# Altium project PCB_Project1.PrjPCB
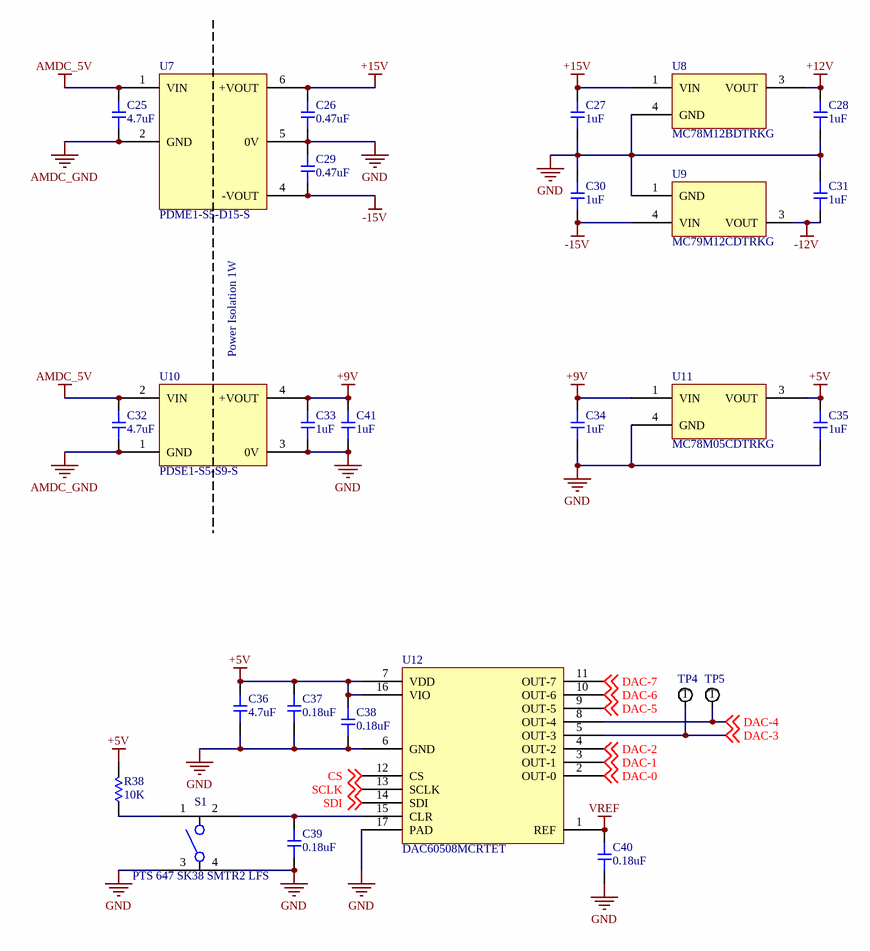
[diagram p0: DAC.SchDoc]
1 sheet, 27 parts. Net scope: global (net labels, ports and power ports of the same name join across sheets).
Board file: PCB1.PcbDoc

## Sheet DAC.SchDoc: DAC
size Letter; Engineer: Brandt Buchda; SheetNumber: 2; SheetTotal: 4

### Parts
C25  value 4.7uF  [0603-CAP]  (hidden comment: CL10A475KA8NQNC)
C26  value 0.47uF  [0603-CAP]  (hidden comment: CL10B474KO8NNNC)
C27  value 1uF  [0603-CAP]  (hidden comment: CL10A105KP8NNNC)
C28  value 1uF  [0603-CAP]  (hidden comment: CL10A105KP8NNNC)
C29  value 0.47uF  [0603-CAP]  (hidden comment: CL10B474KO8NNNC)
C30  value 1uF  [0603-CAP]  (hidden comment: CL10A105KP8NNNC)
C31  value 1uF  [0603-CAP]  (hidden comment: CL10A105KP8NNNC)
C32  value 4.7uF  [0603-CAP]  (hidden comment: CL10A475KA8NQNC)
C33  value 1uF  [0603-CAP]  (hidden comment: CL10A105KP8NNNC)
C34  value 1uF  [0603-CAP]  (hidden comment: CL10A105KP8NNNC)
C35  value 1uF  [0603-CAP]  (hidden comment: CL10A105KP8NNNC)
C36  value 4.7uF  [0603-CAP]  (hidden comment: CL10A475KA8NQNC)
C37  value 0.18uF  [0603-CAP]  (hidden comment: CC0603KRX7R7BB184)
C38  value 0.18uF  [0603-CAP]  (hidden comment: CC0603KRX7R7BB184)
C39  value 0.18uF  [0603-CAP]  (hidden comment: CC0603KRX7R7BB184)
C40  value 0.18uF  [0603-CAP]  (hidden comment: CC0603KRX7R7BB184)
C41  value 1uF  [0603-CAP]  (hidden comment: CL10A105KP8NNNC)
R38  value 10K  [0603-RES]  (hidden comment: ERJ-PB3B1002V)
S1  PTS 647 SK38 SMTR2 LFS  [PTS647SK38SMTR2LFSCT-ND]
TP4  Test Point  [RCU-0C]  (value not drawn)
TP5  Test Point  [RCU-0C]  (value not drawn)
U7  PDME1-S5-D15-S  [PDME1-S5-D15-S]
U8  MC78M12BDTRKG  [DPAK229P991X238-3N]
U9  MC79M12CDTRKG  [DPAK229P991X238-3N]
U10  PDSE1-S5-S9-S  [PDSE1-S5-S9-S]
U11  MC78M05CDTRKG  [DPAK229P991X238-3N]
U12  DAC60508MCRTET  [QFN50P300X300X80_HS-17N]

### Nets
+5V: C35.2 C36.2 C37.2 C38.2 R38.2 U11.3(VOUT) U12.7(VDD) U12.16(VIO)
+9V: C33.2 C34.2 C41.2 U10.4(+VOUT) U11.1(VIN)
+12V: C28.2 U8.3(VOUT)
+15V: C26.2 C27.2 U7.6(+VOUT) U8.1(VIN)
-12V: C31.1 U9.3(VOUT)
-15V: C29.1 C30.1 U7.4(-VOUT) U9.4(VIN)
AMDC_5V: C25.2 C32.2 U7.1(VIN) U10.2(VIN)
AMDC_GND: C25.1 C32.1 U7.2(GND) U10.1(GND)
GND: C26.1 C27.1 C28.1 C29.2 C30.2 C31.2 C33.1 C34.1 C35.1 C36.1 C37.1 C38.1 C39.1 C40.1 C41.1 S1.3 S1.4 U7.5(0V) U8.4(GND) U9.1(GND) U10.3(0V) U11.4(GND) U12.6(GND) U12.17(PAD)
VREF: C40.2 U12.1(REF)
CS: U12.12(CS) ; off-sheet CS
DAC-0: U12.2(OUT-0) ; off-sheet DAC-0
DAC-1: U12.3(OUT-1) ; off-sheet DAC-1
DAC-2: U12.4(OUT-2) ; off-sheet DAC-2
DAC-3: TP4.1 U12.5(OUT-3) ; off-sheet DAC-3
DAC-4: TP5.1 U12.8(OUT-4) ; off-sheet DAC-4
DAC-5: U12.9(OUT-5) ; off-sheet DAC-5
DAC-6: U12.10(OUT-6) ; off-sheet DAC-6
DAC-7: U12.11(OUT-7) ; off-sheet DAC-7
SCLK: U12.13(SCLK) ; off-sheet SCLK
SDI: U12.14(SDI) ; off-sheet SDI
NetC39_2: C39.2 S1.2 U12.15(CLR)
NetR38_1: R38.1 S1.1

### Notes on the sheet
- Power Isolation 1W
- Title:
- File:
- Sheet:
- of
- Revision:
- Time:
- Date:
- Engineer:
- (in symbol Test Point) T

### Library data of the parts
C25 C32 C36 = Capacitor 4.7uF: 4.7µF ±10% 25V Ceramic Capacitor X5R 0603 (1608 Metric); Supplier 1: Digi-Key; Supplier Part Number 1: 1276-1900-1-ND
C26 C29 = Capacitor .47uF: 0.47µF ±10% 16V Ceramic Capacitor X7R 0603 (1608 Metric); Supplier 1: Digi-Key; Supplier Part Number 1: 1276-1062-1-ND
C27 C28 C30 C31 C33-C35 C41 = Capacitor 1uF: 1µF ±10% 10V Ceramic Capacitor X5R 0603 (1608 Metric); Supplier 1: Digi-Key; Supplier Part Number 1: 1276-1182-1-ND
C37-C40 = Capacitor 0.18uF: 0.18µF ±10% 16V Ceramic Capacitor X7R 0603 (1608 Metric); Supplier 1: Digi-Key; Supplier Part Number 1: 311-4066-1-ND
R38 = Resistor 10K: 10 kOhms ±0.1% 0.2W, 1/5W Chip Resistor 0603 (1608 Metric) Automotive AEC-Q200, Pulse Withstanding Thick Film; Supplier 1: Digi-Key; Supplier Part Number 1: P20086CT-ND
S1 = PTS 647 SK38 SMTR2 LFS: Tactile Switch SPST-NO Top Actuated Surface Mount; Supplier 1: Digi-Key; Supplier Part Number 1: PTS647SK38SMTR2LFSCT-ND
TP4 TP5 = Test Point: Material - Insulation: No Insulation; Supplier Part Number: *; Supplier: *; Footprint: *; Supplier 1: Digi-Key; RoHS: RoHS Compliant; Category: Test and Measurement; Stock 1: 136646; Pricing 1: 1=0.22, 10=0.206, 25=0.1756, 50=0.1536, 100=0.1426, 250=0.12616, 500=0.12068, 1000=0.09874 (USD); Packaging: Cut Tape (CT); Part Status: Active; Type: PC Test Point; Mounting Type: Surface Mount; Color: Natural; Size / Dimension: 0.063" x 0.031" x 0.045" (1.60mm x 0.80mm x 1.15mm); Plating: -; Material - Body: -; ComponentLink1URL: http://www.te.com/commerce/DocumentDelivery/DDEController?Action=srchrtrv&DocNm=1773266&DocType=DS&DocLang=English; ComponentLink1Description: http://www.te.com/commerce/DocumentDelivery/DDEController?Action=srchrtrv&DocNm=1773266&DocType=DS&DocLang=English; Supplier Part Number 1: A106145CT-ND
U7 = PDME1-S5-D15-S: Isolated Module DC DC Converter 2 Output 15V -15V   34mA, 34mA 4.5V - 5.5V Input; Supplier 1: Digi-Key; Supplier Part Number 1: 102-6323-ND
U8 = MC78M12BDTRKG: +12 Linear Voltage Regulator IC  1 Output  500mA DPAK; Supplier 1: Digi-Key; Supplier Part Number 1: MC78M12BDTRKGOSCT-ND
U9 = MC79M12CDTRKG: -12 Linear Voltage Regulator IC  1 Output  500mA DPAK; Supplier 1: Digi-Key; Supplier Part Number 1: MC79M12CDTRKGOSCT-ND
U10 = PDSE1-S5-S9-S: Isolated Module DC DC Converter 1 Output 9V    111mA 4.5V - 5.5V Input; Supplier 1: Digi-Key; Supplier Part Number 1: 102-6292-ND
U11 = MC78M05CDTRKG: +5V Linear Voltage Regulator IC  1 Output  500mA DPAK; Supplier 1: Digi-Key; Supplier Part Number 1: MC78M05CDTRKGOSCT-ND
U12 = DAC60508MCRTET: 12 Bit Digital to Analog Converter 8 16-WQFN (3x3); Supplier 1: Digi-Key; Supplier Part Number 1: 296-52288-1-ND